# Altium schematic sheet Com.SchDoc
size A
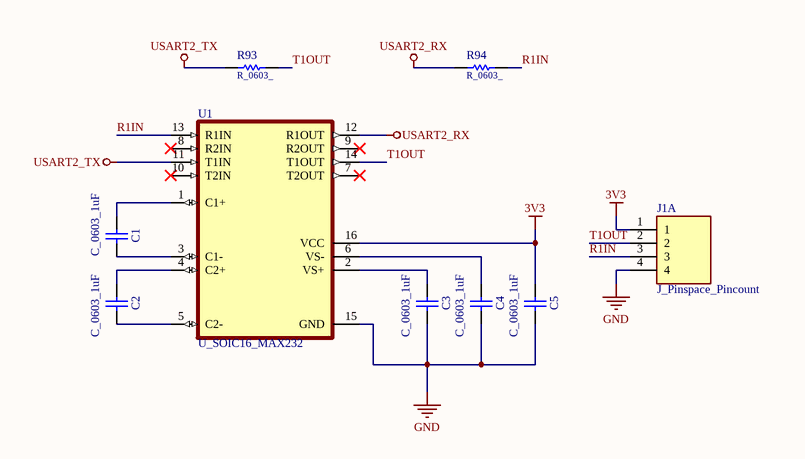
[diagram p0: Com.SchDoc]

## Parts
C1  C_0603_1uF  [CAP 0603]
C2  C_0603_1uF  [CAP 0603]
C3  C_0603_1uF  [CAP 0603]
C4  C_0603_1uF  [CAP 0603]
C5  C_0603_1uF  [CAP 0603]
J1  J_Pinspace_Pincount  [4 Pin PCB TB 3.81]  (part A of 2)
R93  R_0603_  [RES 0603]
R94  R_0603_  [RES 0603]
U1  U_SOIC16_MAX232  [SOIC16]

## Nets
3V3: C5.2 J1.1 U1.16(VCC)
GND: C3.1 C4.1 C5.1 J1.4 U1.15(GND)
USART2_RX: R94.2 U1.12(R1OUT)
USART2_TX: R93.2 U1.11(T1IN)
R1IN: J1.3 R94.1 U1.13(R1IN)
T1OUT: J1.2 R93.1 U1.14(T1OUT)
NetC1_1: C1.1 U1.3(C1-)
NetC1_2: C1.2 U1.1(C1+)
NetC2_1: C2.1 U1.5(C2-)
NetC2_2: C2.2 U1.4(C2+)
NetC3_2: C3.2 U1.2(VS+)
NetC4_2: C4.2 U1.6(VS-)

Not connected (* = marked no-connect by the designer): U1 7(T2OUT)* 8(R2IN)* 9(R2OUT)* 10(T2IN)*

## Library data of the parts
C1-C5 = Cap: Capacitor; Published: 8-Jun-2000; LatestRevisionDate: 17-Jul-2002; LatestRevisionNote: Re-released for DXP Platform.; Publisher: Altium Limited
J1 = 4 Pin PCB Terminal Block: MP: TBP02R1-381-04BE; Availability: Unavailable; Package: None; Price: None; Value: *
R93 R94 = Res: Resistor; Published: 8-Jun-2000; LatestRevisionDate: 17-Jul-2002; LatestRevisionNote: Re-released for DXP Platform.; Publisher: Altium Limited
U1 = MAX232DW: Dual EIA-232 driver and receiver 16-SOIC 0 to 70; MF: Texas Instruments; Price: None; SnapEDA_Link: https://www.snapeda.com/parts/MAX232DW/Texas%20Instruments/view-part/7702/?ref=snap; Purchase-URL: https://pricing.snapeda.com/search/part/MAX232DW/?ref=eda; Check_prices: https://www.snapeda.com/parts/MAX232DW/Texas%20Instruments/view-part/7702/?ref=eda; Value: *; MP: MAX232DW; Package: SOIC-16 Texas Instruments; Availability: Good